# EAGLE design boosst_revB (EAGLE 7.5.0)
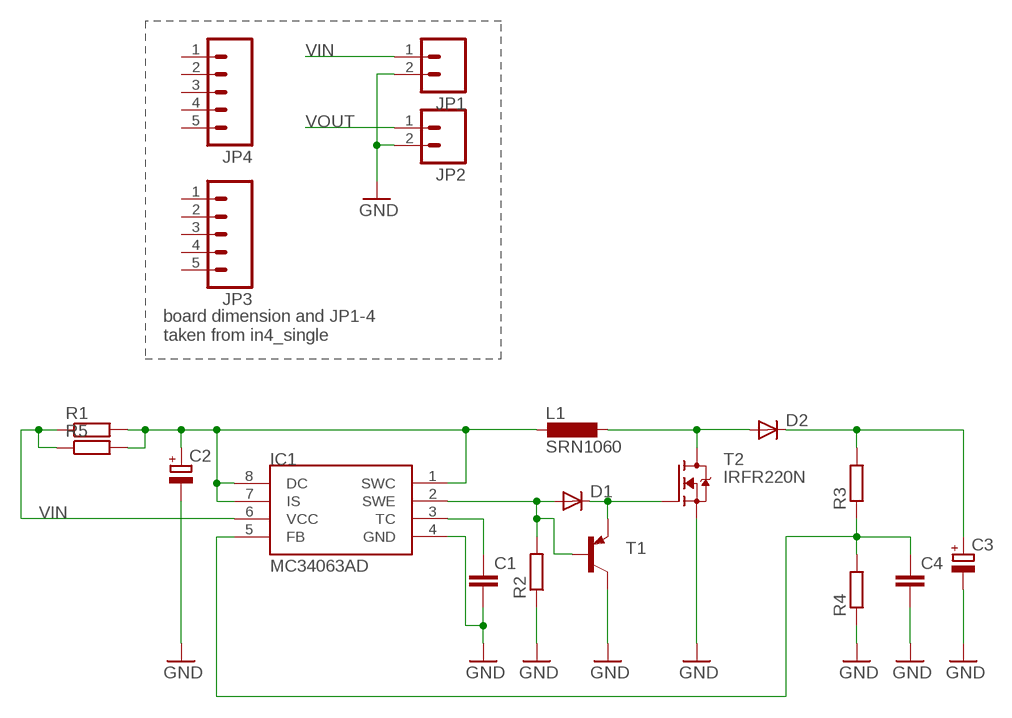
[diagram p0: schematic, sheet 1]

## Parts
C1  C-EUC1206  [C1206]
C2  CPOL-EUE2.5-6  [E2,5-6]
C3  CPOL-EUE2,5-6E  [E2,5-6E]
C4  C-EUC1206  [C1206]
D1  DIODE-SOD123  [SOD123]
D2  DIODE-SMB  [SMB]
IC1  MC34063AD  [SOIC8]
JP1  M02PTH  [1X02]
JP2  M02PTH  [1X02]
JP3  M05PTH  [1X05]
JP4  M05PTH  [1X05]
L1  SRN1060  [SRN1060]
R1  R-EU_M1206  [M1206]
R2  R-EU_R1206  [R1206]
R3  R-EU_R1206  [R1206]
R4  R-EU_R1206  [R1206]
R5  R-EU_M1206  [M1206]
T1  MMBT3906LT1-PNP-SOT23-BEC  [SOT23-BEC]
T2  IRFR220N  [DPACK]

## Nets
GND: C1.2 C2.- C3.- C4.2 IC1.4(GND) JP1.2 JP2.2 R2.1 R4.1 T1.C T2.3(S)
N$2: D1.C T1.E T2.1(G)
N$3: D1.A IC1.2(SWE) R2.2 T1.B
N$4: C1.1 IC1.3(TC)
N$5: C4.1 IC1.5(FB) R3.1 R4.2
N$6: C2.+ IC1.1(SWC) IC1.7(IS) IC1.8(DC) L1.P$2 R1.2 R5.2
SW: D2.A L1.P$1 T2.4(D)
VIN: IC1.6(VCC) JP1.1 R1.1 R5.1
VOUT: C3.+ D2.C JP2.1 R3.2
Unconnected: JP3.1 JP3.2 JP3.3 JP3.4 JP3.5 JP4.1 JP4.2 JP4.3 JP4.4 JP4.5

## Notes on the sheet
- board dimension and JP1-4 
  taken from in4_single

## Library data of the parts
C1 C4 = rcl:C-EU: CAPACITOR, European symbol
C2 C3 = rcl:CPOL-EU: POLARIZED CAPACITOR, European symbol
D1 D2 = diode:DIODE-: DIODE
IC1 = mc34063:MC34063
JP1 JP2 = SparkFun-Connectors:M02: Standard 2-pin 0.1" header. Use with - straight break away headers ( PRT-00116) - right angle break away headers (PRT-00553) - swiss pins (PRT-00743) - machine pins (PRT-00117) - female headers (PRT-00115) Molex polarized connector foot print use with: PRT-08233 with associated crimp pins and housings. 2.54_SCREWTERM for use with PRT-10571. 3.5mm Screw Terminal footprints for PRT-08084 5mm Screw Terminal footprints for use with PRT-08432
JP3 JP4 = SparkFun-Connectors:M05: Header 5 Standard 5-pin 0.1" header. Use with straight break away headers (SKU : PRT-00116), right angle break away headers (PRT-00553), swiss pins (PRT-00743), machine pins (PRT-00117), and female headers (PRT-00115). Molex polarized connector foot print use with SKU : PRT-08230 with associated crimp pins and housings.
L1 = custom_lbr:SRN1060: Bourns SRN1060 Series https://www.bourns.com/data/global/pdfs/SRN1060.pdf
R1-R5 = rcl:R-EU_: RESISTOR, European symbol
T1 = transistor:*-PNP-: PNP Transistror
T2 = custom_lbr:IRFR220N: MOSFET Transistor, N Channel, 5 A, 200 V, 600 mohm, 10 V, 4 V; MFN: IRFR220NPBF; OC_FARNELL: 8649693

## Board
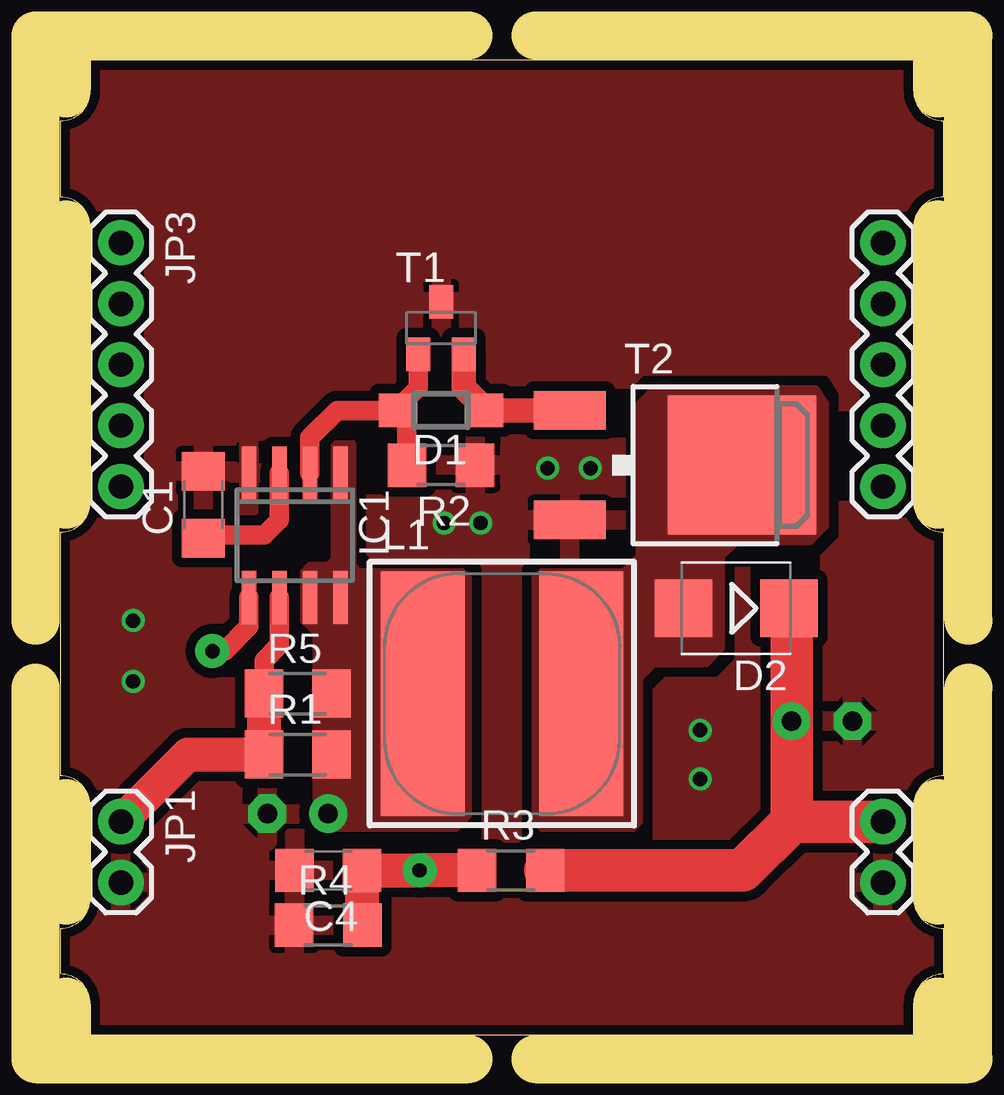
[diagram p1: board, top side]
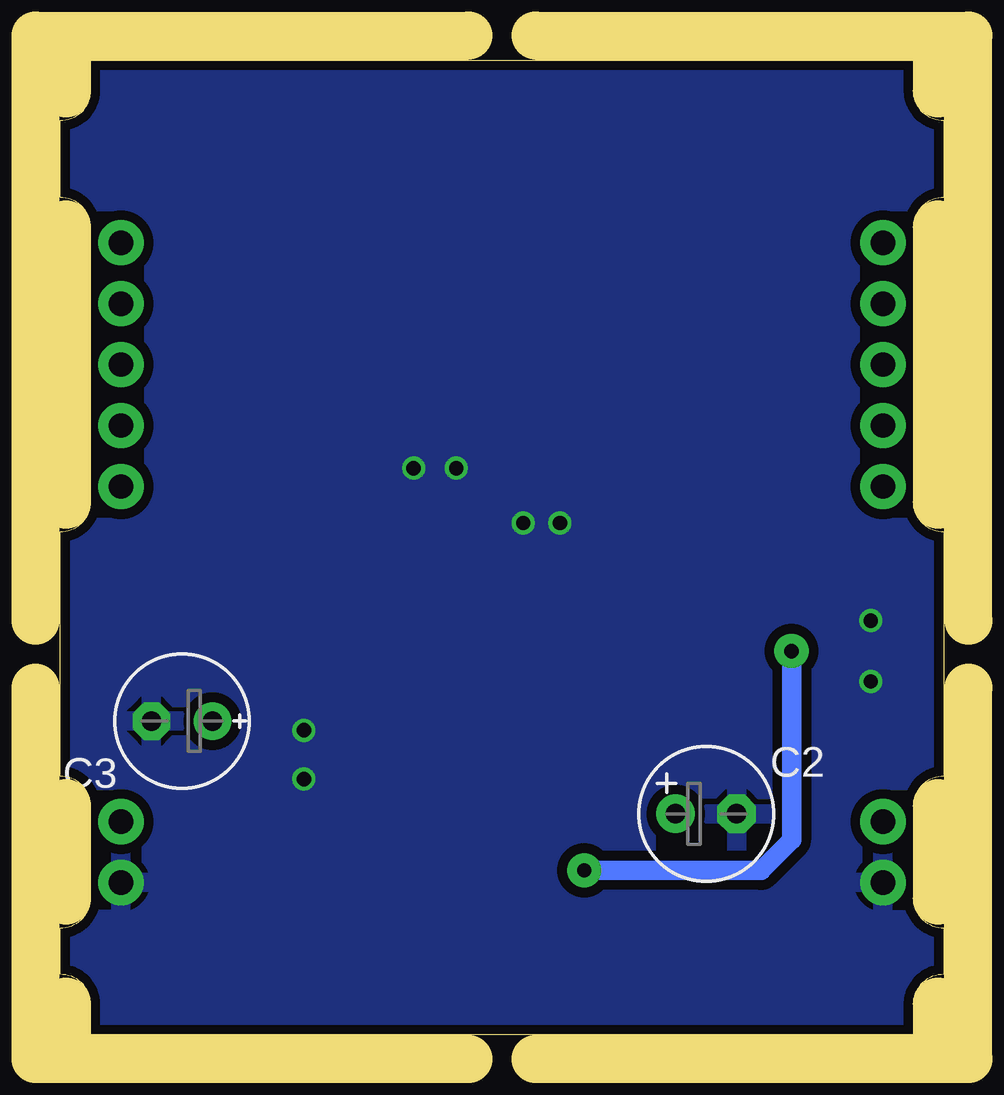
[diagram p2: board, bottom side, seen from below]

Size 36.83 x 40.64 mm. Coordinates in mm from the lower left corner, seen from the top.
Outline: 1.27,0 35.56,0 35.56,1.27 arc-90 36.83,2.54 36.83,4.45 arc-90 35.56,5.71 35.56,9.53 arc-90 36.83,10.79 36.83,20.95 arc-90 35.56,22.23 35.56,33.66 arc-90 36.83,34.92 36.83,38.1 arc-90 35.56,39.37 35.56,40.64 1.27,40.64 1.27,39.37 arc-90 0,38.1 0,34.92 arc-90 1.27,33.66 1.27,22.23 arc-90 0,20.95 0,10.79 arc-90 1.27,9.53 1.27,5.71 arc-90 0,4.45 0,2.54 arc-90 1.27,1.27 1.27,0
Copper layers (1*16): Top 0.0356mm / dielectric 1.5011mm / Bottom 0.0356mm
Design rules "default *": minimum track width 6mil, minimum drill 13mil, track to track 6mil, track to pad 6mil, pad to pad 6mil, via to via 6mil, smd to smd 6mil, copper to edge 10mil, drill to drill 6mil, minimum pad ring 7mil, minimum via ring 7mil, stop-mask expansion 2.5mil, vias tented up to drill 0mil, thermal gap 10mil
Milling: 16 lines

### Footprints (pad centres in the part's own frame; a part is rotated, then mirrored left to right if it is on the bottom)
C1206 = smd 1.6 x 1.8: 1 -1.4,0; 2 1.4,0
E2,5-6 = drill 0.813 pad 1.6: + -1.27,0 | drill 0.813 pad 1.6 octagon: - 1.27,0
E2,5-6E = drill 0.813 pad 1.575: + -1.27,0 | drill 0.813 pad 1.575 octagon: - 1.27,0
SOD123 = smd 1.4 x 1.4: A 1.9,0; C -1.9,0
SMB = smd 2.4 x 2.4: A 2.2,0; C -2.2,0
SOIC8 = smd 0.6 x 2.2: 1 -1.905,-2.6; 2 -0.635,-2.6; 3 0.635,-2.6; 4 1.905,-2.6; 5 1.905,2.6; 6 0.635,2.6; 7 -0.635,2.6; 8 -1.905,2.6
1X02 = drill 1.016 pad 1.88: 1 0,0; 2 2.54,0
1X05 = drill 1.016 pad 1.88: 1 0,0; 2 2.54,0; 3 5.08,0; 4 7.62,0; 5 10.16,0
SRN1060 = smd 3.5 x 10.2: P$1 3.3,0; P$2 -3.3,0
M1206 = smd 1.6 x 2: 1 -1.4,0; 2 1.4,0
R1206 = smd 1.6 x 1.803: 1 -1.422,0; 2 1.422,0
SOT23-BEC = smd 1 x 1.4: B -0.95,-1.1; C 0,1.1; E 0.95,-1.1
DPACK = smd 1.6 x 3: 1 -2.28,-4.8; 3 2.28,-4.8 | smd 5.8 x 6.2: 4 0,2.38

### Placement (x,y rotation side)
C1  5.97,22.1 90 top
C2  9.91,9.22 0 bottom
C3  31.75,13.08 180 bottom
C4  11.18,6.86 180 top
D1  15.88,26.04 180 top
D2  28.17,17.78 180 top
IC1  9.78,20.83 180 top
JP1  2.54,8.89 270 top
JP2  34.29,8.89 270 top
JP3  2.54,33.02 270 top
JP4  34.29,33.02 270 top
L1  18.41,14.22 0 top
R1  9.91,11.68 0 top
R2  15.88,23.75 180 top
R3  18.8,6.86 0 top
R4  11.18,4.57 0 top
R5  9.91,14.22 0 top
T1  15.88,29.46 0 top
T2  26.04,23.75 270 top

### Tracks (layer width: path | path; a pad name or v marks a point on that pad's centre or on a via)
GND  (via drill 0.6)
  other vias: 17.53,21.34 16,21.34 20.32,23.62 22.1,23.62 3.05,17.27 3.05,14.73 26.67,12.7 26.67,10.67
  pour Top (isolate 0.406, rank 6): 0,0 36.83,0 36.83,40.64 0,40.64
  pour Bottom (isolate 0.406, rank 6): 0.25,0 36.83,0 36.83,40.64 0,40.64 0,0
N$2
  Top 1.016: T2.1 21.5,26.29 21.59,26.29 21.34,26.04 D1.C 16.82,26.98 T1.E
N$3
  Top 0.813: R2.2 14.45,25.56 D1.A | T1.B 14.93,26.98 D1.A | IC1.2 10.41,24.89 11.56,26.04 D1.A
N$4
  Top 0.813: IC1.3 9.14,21.46 8.51,20.83 6.1,20.83 C1.1
N$5  (via drill 0.6 pad 1.42)
  Top 0.813: IC1.5 7.87,17.02 6.86,16 v6.35,16
  Top 1.422: R3.1 v14.99,6.86 C4.1 12.6,6.84 R4.2
  Bottom 0.813: v6.35,16 6.35,8.13 7.62,6.86 v14.99,6.86
N$6
  pour Top (isolate 0.406, no thermals): 11.18,19.56 10.41,19.56 10.16,19.3 10.16,17.27 10.67,16.76 10.67,9.4 11.43,8.64 16.51,8.64 17.02,9.14 17.02,19.05 16.76,19.3 12.45,19.3 12.19,19.56 12.19,24.64 11.43,24.64 11.43,19.81
SW
  pour Top (no thermals): 19.81,19.05 19.81,8.89 20.07,8.64 23.88,8.64 24.13,8.89 24.13,14.86 24.77,15.49 26.92,15.49 27.56,16.13 27.56,19.94 28.19,20.57 31.24,20.57 31.88,21.21 31.88,26.29 31.5,26.92 24.77,26.92 24.13,26.29 24.13,19.94 23.5,19.3 20.07,19.3
VIN
  Top 0.813: R5.1 8.51,15.62 9.14,16.26 IC1.6
  Top 1.422: JP1.1 5.33,11.68 R1.1 R5.1
VOUT
  Top 1.422: 30.48,17.67 D2.C | 30.48,8.89 30.48,9.14 30.73,8.89
  Top 1.778: 30.48,17.67 C3.+ 30.48,9.14 | R3.2 28.45,6.86 30.48,8.89 | JP2.1 30.73,8.89